# EAGLE schematic RFIDLER V22 beta (EAGLE 6.5.0)
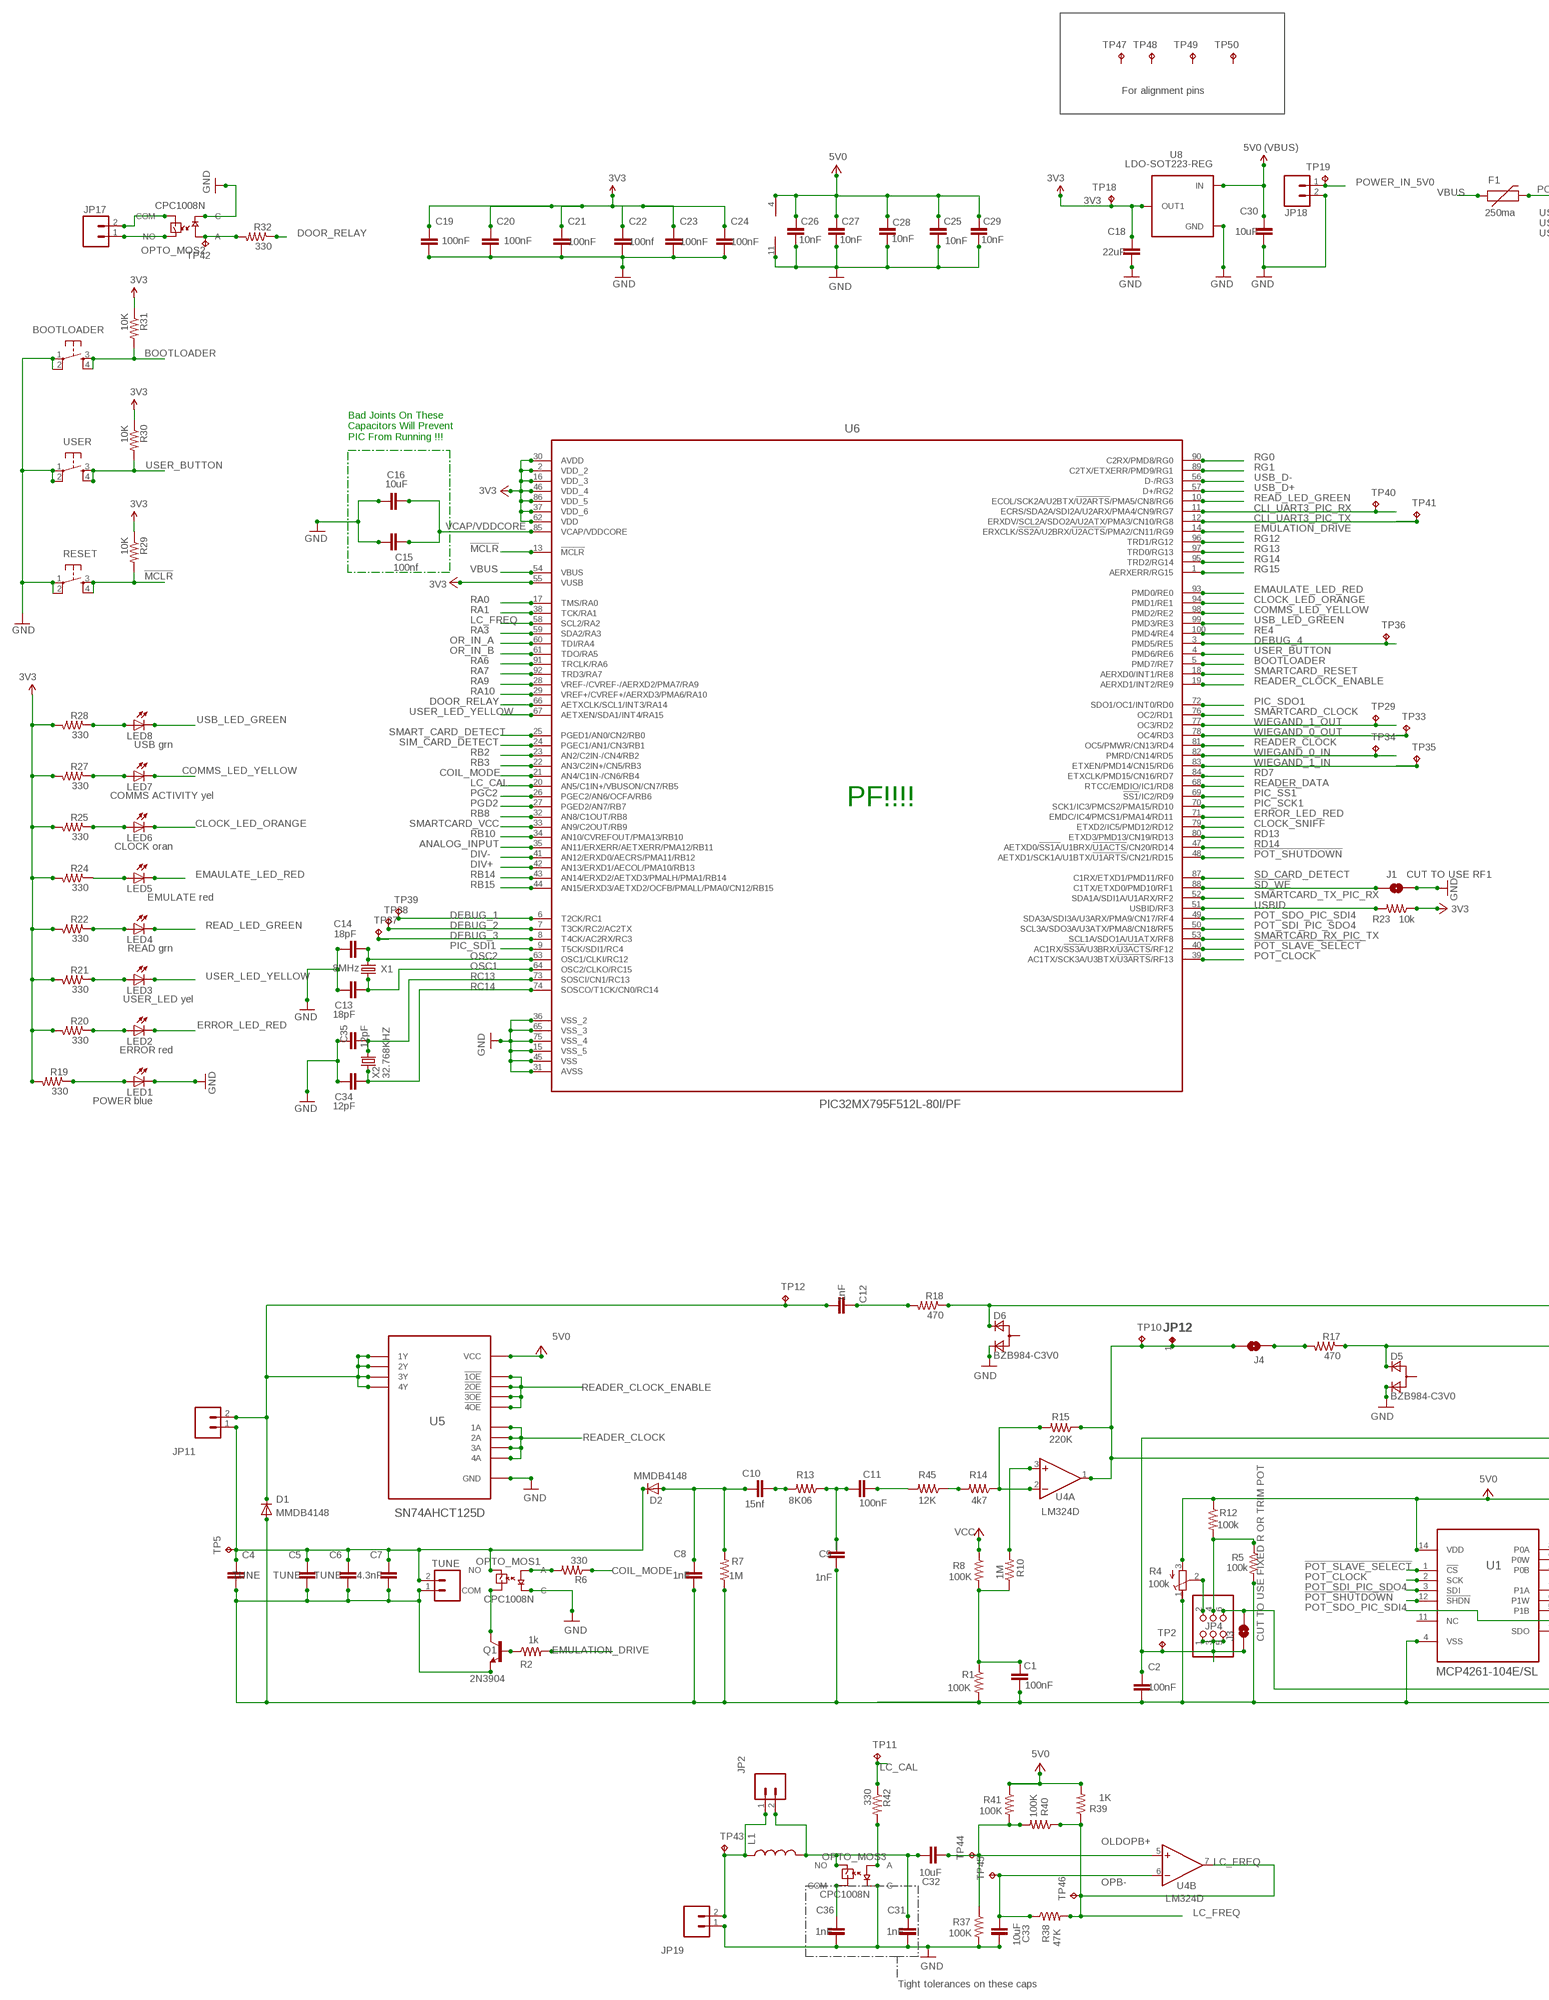
[diagram p0: schematic, sheet 1, part 1 of 2]
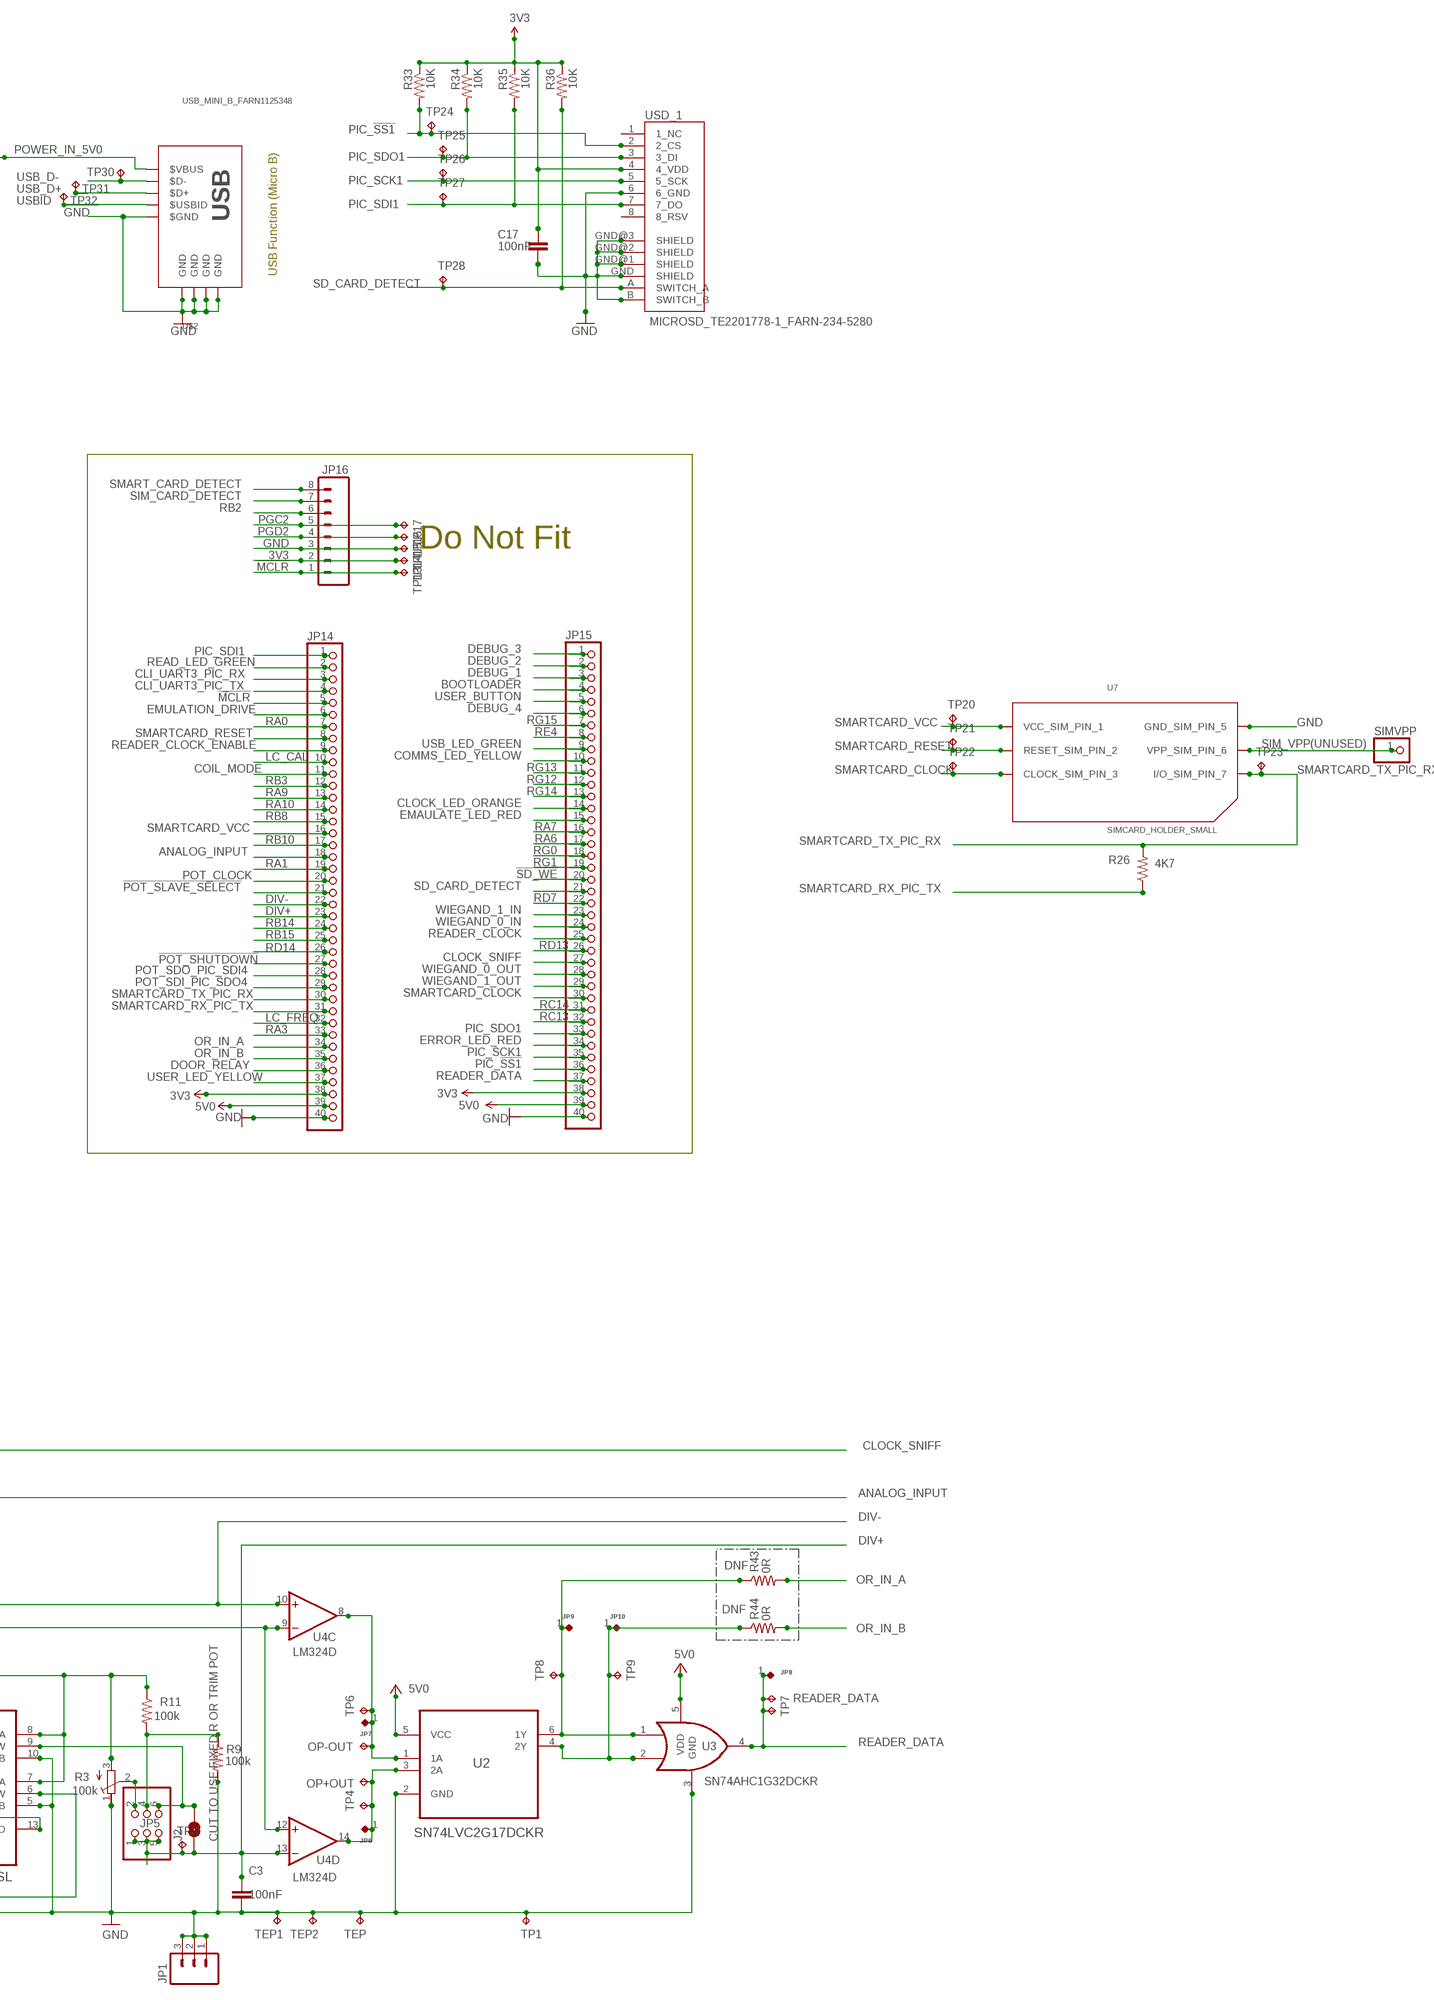
[diagram p1: schematic, sheet 1, part 2 of 2]

## Parts
BOOTLOADER  TAC_SWITCHSMD  [TACTILE_SWITCH_SMD]
C1  100nF  CAP0603-CAP  [0603-CAP]
C2  100nF  C-EUC0603  [C0603]
C3  100nF  C-EUC0603  [C0603]
C4  TUNE  C-EUC0603  [C0603]
C5  TUNE  C-EUC0603  [C0603]
C6  TUNE  C-EUC0603  [C0603]
C7  4.3nF  C-EUC0603  [C0603]
C8  1nF  C-EUC0603  [C0603]
C9  1nF  C-EUC0603  [C0603]
C10  15nf  C-EUC0603  [C0603]
C11  100nF  C-EUC0603  [C0603]
C12  1nF  C-EUC0603  [C0603]
C13  18pF  C-EUC0603  [C0603]
C14  18pF  C-EUC0603  [C0603]
C15  100nf  C-EUC0603  [C0603]
C16  10uF  C-EUC0805  [C0805]
C17  100nF  C-EUC0603  [C0603]
C18  22uF  C-EUC0805  [C0805]
C19  100nF  C-EUC0603  [C0603]
C20  100nF  C-EUC0603  [C0603]
C21  100nF  C-EUC0603  [C0603]
C22  100nf  C-EUC0603  [C0603]
C23  100nF  C-EUC0603  [C0603]
C24  100nF  C-EUC0603  [C0603]
C25  10nF  C-EUC0603  [C0603]
C26  10nF  C-EUC0603  [C0603]
C27  10nF  C-EUC0603  [C0603]
C28  10nF  C-EUC0603  [C0603]
C29  10nF  C-EUC0603  [C0603]
C30  10uF  C-EUC0805  [C0805]
C31  1nF  C-EUC0603  [C0603]
C32  10uF  C-EUC0805  [C0805]
C33  10uF  C-EUC0805  [C0805]
C34  12pF  C-EUC0603  [C0603]
C35  12pF  C-EUC0603  [C0603]
C36  1nF  C-EUC0603  [C0603]
D1  MMDB4148  DIODESOT23  [SOT23-3]
D2  MMDB4148  DIODESOT23  [SOT23-3]
D5  BZB984-C3V0  BZB984  [SOT663]
D6  BZB984-C3V0  BZB984  [SOT663]
F1  250ma  PTCSMD  [PTC-1206]
J1  CUT TO USE RF1  SOLDERJUMPERTRACE  [SJ_2S-TRACE]
J2  CUT TO USE FIXED R OR TRIM POT  SOLDERJUMPERTRACE  [SJ_2S-TRACE]
J3  CUT TO USE FIXED R OR TRIM POT  SOLDERJUMPERTRACE  [SJ_2S-TRACE]
J4  SOLDERJUMPERTRACE  [SJ_2S-TRACE]
JP1  M03LOCK_LONGPADS  [1X03_LOCK_LONGPADS]
JP2  M02LOCK_LONGPADS  [1X02_LOCK_LONGPADS]
JP4  PINHD-2X3  [2X03]
JP5  PINHD-2X3  [2X03]
JP6  PINHD-1X1  [1X01]
JP7  PINHD-1X1  [1X01]
JP8  PINHD-1X1  [1X01]
JP9  PINHD-1X1  [1X01]
JP10  PINHD-1X1  [1X01]
JP11  M02LOCK_LONGPADS  [1X02_LOCK_LONGPADS]
JP12  PINHD-1X1  [1X01]
JP14  PINHD-1X40  [1X40]
JP15  PINHD-1X40  [1X40]
JP16  M08  [1X08]
JP17  M02LOCK_LONGPADS  [1X02_LOCK_LONGPADS]
JP18  M02LOCK_LONGPADS  [1X02_LOCK_LONGPADS]
JP19  M02LOCK_LONGPADS  [1X02_LOCK_LONGPADS]
L1  INDUCTOR0603  [0603]
LED1  POWER blue  LED0603  [LED-0603]
LED2  ERROR red  LED0603  [LED-0603]
LED3  USER_LED yel  LED0603  [LED-0603]
LED4  READ grn  LED0603  [LED-0603]
LED5  EMULATE red  LED0603  [LED-0603]
LED6  CLOCK oran  LED0603  [LED-0603]
LED7  COMMS ACTIVITY yel  LED0603  [LED-0603]
LED8  USB grn  LED0603  [LED-0603]
OP+OUT  TPPAD1-13  [P1-13]
OP-OUT  TPPAD1-13  [P1-13]
OPTO_MOS1  CPC1008N  [CPC1008N]
OPTO_MOS2  CPC1008N  [CPC1008N]
OPTO_MOS3  CPC1008N  [CPC1008N]
Q1  2N3904  TRANSISTOR_NPNSOT323(SC-70)  [SOT323]
R1  100K  R-US_R0603  [R0603]
R2  1k  R-US_R0603  [R0603]
R3  100k  R-TRIMMT93XA  [RTRIMT93XA]
R4  100k  R-TRIMMT93XA  [RTRIMT93XA]
R5  100k  R-US_R0603  [R0603]
R6  330  R-US_R0603  [R0603]
R7  1M  R-US_R0603  [R0603]
R8  100K  R-US_R0603  [R0603]
R9  100k  R-US_R0603  [R0603]
R10  1M  R-US_R0603  [R0603]
R11  100k  R-US_R0603  [R0603]
R12  100k  R-US_R0603  [R0603]
R13  8K06  R-US_R0603  [R0603]
R14  4k7  R-US_R0603  [R0603]
R15  220K  R-US_R0603  [R0603]
R17  470  R-US_R0603  [R0603]
R18  470  R-US_R0603  [R0603]
R19  330  R-US_R0603  [R0603]
R20  330  R-US_R0603  [R0603]
R21  330  R-US_R0603  [R0603]
R22  330  R-US_R0603  [R0603]
R23  10k  R-US_R0603  [R0603]
R24  330  R-US_R0603  [R0603]
R25  330  R-US_R0603  [R0603]
R26  4K7  R-US_R0603  [R0603]
R27  330  R-US_R0603  [R0603]
R28  330  R-US_R0603  [R0603]
R29  10K  R-US_R0603  [R0603]
R30  10K  R-US_R0603  [R0603]
R31  10K  R-US_R0603  [R0603]
R32  330  R-US_R0603  [R0603]
R33  10K  R-US_R0603  [R0603]
R34  10K  R-US_R0603  [R0603]
R35  10K  R-US_R0603  [R0603]
R36  10K  R-US_R0603  [R0603]
R37  100K  R-US_R0603  [R0603]
R38  47K  R-US_R0603  [R0603]
R39  1K  R-US_R0603  [R0603]
R40  100K  R-US_R0603  [R0603]
R41  100K  R-US_R0603  [R0603]
R42  330  R-US_R0603  [R0603]
R43  0R  R-US_R0603  [R0603]
R44  0R  R-US_R0603  [R0603]
R45  12K  R-US_R0603  [R0603]
READER_DATA  TPPAD1-13  [P1-13]
RESET  TAC_SWITCHSMD  [TACTILE_SWITCH_SMD]
SIMVPP  PINHD-1X1  [1X01]
TEP  TPPAD1-13  [P1-13]
TEP1  TPPAD1-13  [P1-13]
TEP2  TPPAD1-13  [P1-13]
TP1  DOWNS_ORIN1  TPTP20R  [TP20R]
TP2  DIV-  TPTP20R  [TP20R]
TP3  DIV+  TPTP20R  [TP20R]
TP4  OP-OUT  TPTP20R  [TP20R]
TP5  COIL_B  TPTP20R  [TP20R]
TP6  OP+OUT  TPTP20R  [TP20R]
TP7  READER_DATA  TPTP20R  [TP20R]
TP8  UPS_ORIN1  TPTP20R  [TP20R]
TP9  DOWNS_ORIN1  TPTP20R  [TP20R]
TP10  RAW_READER_OUT  TPTP20R  [TP20R]
TP11  LC_CAL  TPTP20R  [TP20R]
TP12  COIL_A  TPTP20R  [TP20R]
TP13  !MCLR  TPTP20R  [TP20R]
TP14  3V3  TPTP20R  [TP20R]
TP15  GND  TPTP20R  [TP20R]
TP16  PGD2  TPTP20R  [TP20R]
TP17  PGC2  TPTP20R  [TP20R]
TP18  DOWNS_ORIN1  TPTP20R  [TP20R]
TP19  POWER_IN_5V0  TPTP20R  [TP20R]
TP20  SMARTCARD_VCC  TPTP20R  [TP20R]
TP21  SMARTCARD_RESET  TPTP20R  [TP20R]
TP22  SMARTCARD_CLOCK  TPTP20R  [TP20R]
TP23  SMARTCARD_TX_PIC_RX  TPTP20R  [TP20R]
TP24  PIC_!SS1  TPTP20R  [TP20R]
TP25  PIC_SDO1  TPTP20R  [TP20R]
TP26  PIC_SCK1  TPTP20R  [TP20R]
TP27  PIC_SDI1  TPTP20R  [TP20R]
TP28  SD_CARD_DETECT  TPTP20R  [TP20R]
TP29  WIEGAND_1_OUT  TPTP20R  [TP20R]
TP30  USB_D-  TPTP20R  [TP20R]
TP31  USB_D+  TPTP20R  [TP20R]
TP32  USBID  TPTP20R  [TP20R]
TP33  WIE0OUT  TPTP20R  [TP20R]
TP34  WIE0IN  TPTP20R  [TP20R]
TP35  WIE1IN  TPTP20R  [TP20R]
TP36  DEBUG_4  TPTP20R  [TP20R]
TP37  DEBUG_3  TPTP20R  [TP20R]
TP38  DEBUG_2  TPTP20R  [TP20R]
TP39  DEBUG_1  TPTP20R  [TP20R]
TP40  CLI_UART3_PIC_RX  TPTP20R  [TP20R]
TP41  CLI_UART3_PIC_TX  TPTP20R  [TP20R]
TP42  RELAY  TPTP20R  [TP20R]
TP43  LC_COIL  TPTP20R  [TP20R]
TP44  LC+  TPTP20R  [TP20R]
TP45  LC-  TPTP20R  [TP20R]
TP46  LCOUT  TPTP20R  [TP20R]
TP47  PEG4  TPTP20R  [TP20R]
TP48  PEG1  TPTP20R  [TP20R]
TP49  PEG3  TPTP20R  [TP20R]
TP50  PEG2  TPTP20R  [TP20R]
TUNE  M02LOCK_LONGPADS  [1X02_LOCK_LONGPADS]
U1  MCP4261-104E/SL  [SOIC127P600X175-14N]
U2  SN74LVC2G17DCKR  [SOT65P210X110-6N]
U3  SN74AHC1G32DCKR  [SC70-5L]
U4  LM324D  [SO14]
U5  SN74AHCT125D  [SOIC127P600X175-14N]
U6  PIC32MX795F512L-80I/PF  [QFP50P1600X1600X120-100N]
U7  SIMCARD_HOLDER_SMALL  [SIM_CARD_CONN]
U8  LDO-SOT223-REG  [SOT223]
U$2  USB_MINI_B_FARN1125348  [USB_MINI_B_FARN1125348]
USD_1  MICROSD_TE2201778-1_FARN-234-5280  [MICROSD_TE2201778-1_FARN-234-5280]
USER  TAC_SWITCHSMD  [TACTILE_SWITCH_SMD]
X1  8MHz  CRYSTALHC49UP  [HC49UP]
X2  32.768KHZ  CRYSTALTC38H  [TC38H]

## Nets
3V3: C17.1 C18.1 C19.1 C20.1 C21.1 C22.1 C23.1 C24.1 JP14.38 JP15.38 JP16.2 R19.2 R20.2 R21.2 R22.2 R23.1 R24.2 R25.2 R27.2 R28.2 R29.1 R30.1 R31.1 R33.1 R34.1 R35.1 R36.1 TP14.TP TP18.TP U6.2(VDD_2) U6.16(VDD_3) U6.30(AVDD) U6.37(VDD_6) U6.46(VDD_4) U6.55(VUSB) U6.62(VDD) U6.86(VDD_5) U8.P$2@2(OUT1) USD_1.4(4_VDD)
!MCLR: JP14.5 JP16.1 R29.2 RESET.3 RESET.4 TP13.TP U6.13(!MCLR)
!POT_SHUTDOWN: JP14.27 U1.12(!SHDN) U6.48(AETXD1/SCK1A/U1BTX/!U1ARTS!/CN21/RD15)
!POT_SLAVE_SELECT: JP14.21 U1.1(!CS) U6.40(AC1RX/!SS3A!/U3BRX/!U3ACTS!/RF12)
!SD_WE: J1.1 JP15.20 U6.88(C1TX/ETXD0/PMD10/RF1)
ANALOG_INPUT: D5.P$1(C1) JP14.18 R17.1 U6.35(AN11/ERXERR/AETXERR/PMA12/RB11)
BOOTLOADER: BOOTLOADER.3 BOOTLOADER.4 JP15.4 R31.2 U6.5(PMD7/RE7)
CLI_UART3_PIC_RX: JP14.3 TP40.TP U6.11(ECRS/SDA2A/SDI2A/U2ARX/PMA4/CN9/RG7)
CLI_UART3_PIC_TX: JP14.4 TP41.TP U6.12(ERXDV/SCL2A/SDO2A/U2ATX/PMA3/CN10/RG8)
CLOCK: C12.2 D1.3(C) JP11.2 TP12.TP U5.3(1Y) U5.6(2Y) U5.8(3Y) U5.11(4Y)
CLOCK_LED_ORANGE: JP15.14 LED6.C U6.94(PMD1/RE1)
CLOCK_SNIFF: D6.P$1(C1) JP15.27 R18.1 U6.79(ETXD2/IC5/PMD12/RD12)
COIL: C4.1 C5.1 C6.1 C7.1 D2.3(C) JP11.1 OPTO_MOS1.NO TP5.TP TUNE.2
COIL_MODE: JP14.11 R6.1 U6.21(AN4/C1IN-/CN6/RB4)
COMMS_LED_YELLOW: JP15.10 LED7.C U6.98(PMD2/RE2)
DEBUG_1: JP15.3 TP39.TP U6.6(T2CK/RC1)
DEBUG_2: JP15.2 TP38.TP U6.7(T3CK/RC2/AC2TX)
DEBUG_3: JP15.1 TP37.TP U6.8(T4CK/AC2RX/RC3)
DEBUG_4: JP15.6 TP36.TP U6.3(PMD5/RE5)
DIV+: C3.1 J2.1 JP5.1 JP5.3 JP5.5 JP14.23 TP3.TP U4.13(D:-IN) U6.42(AN13/ERXD1/AECOL/PMA10/RB13)
DIV-: C2.1 J3.1 JP4.1 JP4.3 JP4.5 JP14.22 TP2.TP U4.10(C:+IN) U6.41(AN12/ERXD0/AECRS/PMA11/RB12)
DOOR_RELAY: JP14.36 R32.1 U6.66(AETXCLK/SCL1/INT3/RA14)
DOWNS_ORIN1: JP10.1 R44.1 TP9.TP U2.4(2Y) U3.2(B)
EMAULATE_LED_RED: JP15.15 LED5.C U6.93(PMD0/RE0)
EMULATION_DRIVE: JP14.6 R2.2 U6.14(ERXCLK/!SS2A!/U2BRX/!U2ACTS!/PMA2/CN11/RG9)
ERROR_LED_RED: JP15.34 LED2.C U6.71(EMDC/IC4/PMCS1/PMA14/RD11)
GND [power]: BOOTLOADER.1 BOOTLOADER.2 C1.2 C2.2 C3.2 C4.2 C5.2 C6.2 C7.2 C8.2 C9.1 C13.1 C14.1 C15.2 C16.2 C17.2 C18.2 C19.2 C20.2 C21.2 C22.2 C23.2 C24.2 C25.1 C26.2 C27.2 C28.2 C29.2 C30.2 C31.2 C33.1 C34.1 C35.1 C36.2 D1.1(A) D5.P$2(C2) D6.P$2(C2) J1.2 JP1.1 JP1.2 JP1.3 JP14.40 JP15.40 JP16.3 JP18.2 JP19.1 LED1.C OPTO_MOS1.C OPTO_MOS2.C OPTO_MOS3.C Q1.3(E) R1.2 R3.1(A) R4.1(A) R5.2 R7.1 R9.2 R37.2 RESET.1 RESET.2 TEP1.TP TEP2.TP TEP.TP TP1.TP TP15.TP TUNE.1 U1.4(VSS) U1.5(P1B) U1.10(P0B) U2.2(GND) U3.3(GND) U4.11(P:V-) U5.7(GND) U6.15(VSS_5) U6.31(AVSS) U6.36(VSS_2) U6.45(VSS) U6.65(VSS_3) U6.75(VSS_4) U7.CARD_GND_PIN5(GND_SIM_PIN_5) U8.P$1(GND) U$2.GND($GND) U$2.GND@1(GND) U$2.GND@2(GND) U$2.GND@3(GND) U$2.GND@4(GND) USD_1.6(6_GND) USD_1.B(SWITCH_B) USD_1.GND(SHIELD) USD_1.GND@1(SHIELD) USD_1.GND@2(SHIELD) USD_1.GND@3(SHIELD) USER.1 USER.2
LC_CAL: JP14.10 R42.1 TP11.TP U6.20(AN5/C1IN+/VBUSON/CN7/RB5)
LC_COIL: C31.1 C32.1 JP2.2 L1.2 OPTO_MOS3.NO
LC_FREQ: JP14.32 R38.2 R39.1 R40.1 TP46.TP U4.7(B:OUT) U6.58(SCL2/RA2)
N$2: JP4.2 R4.2(S)
N$3: OPTO_MOS3.A R42.2
N$4: C36.1 OPTO_MOS3.COM
N$5: C8.1 C10.1 D2.1(A) R7.2
N$6: C10.2 R13.2
N$7: C9.2 C11.2 R13.1
N$8: C11.1 R45.2
N$9: R14.1 R15.2 U4.2(A:-IN)
N$10: Q1.1(B) R2.1
N$11: JP2.1 JP19.2 L1.1 TP43.TP
N$12: R10.2 U4.3(A:+IN)
N$13: J3.2 JP4.6 U1.6(P1W)
N$14: LED4.A R22.1
N$16: JP5.2 R3.2(S)
N$17: LED3.A R21.1
N$18: J2.2 JP5.6 U1.9(P0W)
N$19: OPTO_MOS1.COM Q1.2(C)
N$21: JP4.4 R5.1 R12.2
N$24: OPTO_MOS1.A R6.2
N$25: JP5.4 R9.1 R11.2
N$26: C12.1 R18.2
N$27: LED1.A R19.1
N$28: LED2.A R20.1
N$29: OPTO_MOS2.A R32.2 TP42.TP
N$30: JP17.1 OPTO_MOS2.NO
N$31: JP17.2 OPTO_MOS2.COM
N$35: J4.1 R17.2
N$38: R14.2 R45.1
N$105: LED8.A R28.1
N$106: LED7.A R27.1
N$107: LED5.A R24.1
N$108: LED6.A R25.1
OLDOPB+: C32.2 R37.1 R40.2 R41.2 TP44.TP U4.5(B:+IN)
OP+OUT: JP7.1 OP-OUT.TP TP6.TP U2.1(1A) U4.8(C:OUT)
OP-OUT: JP6.1 OP+OUT.TP TP4.TP U2.3(2A) U4.14(D:OUT)
OPB-: C33.2 R38.1 TP45.TP U4.6(B:-IN)
OR_IN_A: JP14.34 R43.2 U6.60(TDI/RA4)
OR_IN_B: JP14.35 R44.2 U6.61(TDO/RA5)
OSC1: C13.2 U6.64(OSC2/CLKO/RC15) X1.1
OSC2: C14.2 U6.63(OSC1/CLKI/RC12) X1.2
PGC2: JP16.5 TP17.TP U6.26(PGEC2/AN6/OCFA/RB6)
PGD2: JP16.4 TP16.TP U6.27(PGED2/AN7/RB7)
PIC_!SS1: JP15.36 R33.2 TP24.TP U6.69(!SS1!/IC2/RD9) USD_1.2(2_CS)
PIC_SCK1: JP15.35 TP26.TP U6.70(SCK1/IC3/PMCS2/PMA15/RD10) USD_1.5(5_SCK)
PIC_SDI1: JP14.1 R35.2 TP27.TP U6.9(T5CK/SDI1/RC4) USD_1.7(7_DO)
PIC_SDO1: JP15.33 R34.2 TP25.TP U6.72(SDO1/OC1/INT0/RD0) USD_1.3(3_DI)
POT_CLOCK: JP14.20 U1.2(SCK) U6.39(AC1TX/SCK3A/U3BTX/!U3ARTS!/RF13)
POT_SDI_PIC_SDO4: JP14.29 U1.3(SDI) U6.50(SCL3A/SDO3A/U3ATX/PMA8/CN18/RF5)
POT_SDO_PIC_SDI4: JP14.28 U1.13(SDO) U6.49(SDA3A/SDI3A/U3ARX/PMA9/CN17/RF4)
POWER_IN_5V0: F1.2 JP18.1 TP19.TP U$2.VBUS($VBUS)
RA0: JP14.7 U6.17(TMS/RA0)
RA1: JP14.19 U6.38(TCK/RA1)
RA3: JP14.33 U6.59(SDA2/RA3)
RA6: JP15.17 U6.91(TRCLK/RA6)
RA7: JP15.16 U6.92(TRD3/RA7)
RA9: JP14.13 U6.28(VREF-/CVREF-/AERXD2/PMA7/RA9)
RA10: JP14.14 U6.29(VREF+/CVREF+/AERXD3/PMA6/RA10)
RAW_READER_OUT: J4.2 JP12.1 R15.1 TP10.TP U4.1(A:OUT) U4.9(C:-IN) U4.12(D:+IN)
RB2: JP16.6 U6.23(AN2/C2IN-/CN4/RB2)
RB3: JP14.12 U6.22(AN3/C2IN+/CN5/RB3)
RB8: JP14.15 U6.32(AN8/C1OUT/RB8)
RB10: JP14.17 U6.34(AN10/CVREFOUT/PMA13/RB10)
RB14: JP14.24 U6.43(AN14/ERXD2/AETXD3/PMALH/PMA1/RB14)
RB15: JP14.25 U6.44(AN15/ERXD3/AETXD2/OCFB/PMALL/PMA0/CN12/RB15)
RC13: C35.2 JP15.32 U6.73(SOSCI/CN1/RC13) X2.2
RC14: C34.2 JP15.31 U6.74(SOSCO/T1CK/CN0/RC14) X2.1
RD7: JP15.22 U6.84(ETXCLK/PMD15/CN16/RD7)
RD13: JP15.26 U6.80(ETXD3/PMD13/CN19/RD13)
RD14: JP14.26 U6.47(AETXD0/!SS1A!/U1BRX/!U1ACTS!/CN20/RD14)
RE4: JP15.8 U6.100(PMD4/RE4)
READ_LED_GREEN: JP14.2 LED4.C U6.10(ECOL/SCK2A/U2BTX/!U2ARTS!/PMA5/CN8/RG6)
READER_CLOCK: JP15.25 U5.2(1A) U5.5(2A) U5.9(3A) U5.12(4A) U6.81(OC5/PMWR/CN13/RD4)
READER_CLOCK_ENABLE: JP14.9 U5.1(!1OE) U5.4(!2OE) U5.10(!3OE) U5.13(!4OE) U6.19(AERXD1/INT2/RE9)
READER_DATA: JP8.1 JP15.37 READER_DATA.TP TP7.TP U3.4(Y) U6.68(RTCC/EMDIO/IC1/RD8)
RG0: JP15.18 U6.90(C2RX/PMD8/RG0)
RG1: JP15.19 U6.89(C2TX/ETXERR/PMD9/RG1)
RG12: JP15.12 U6.96(TRD1/RG12)
RG13: JP15.11 U6.97(TRD0/RG13)
RG14: JP15.13 U6.95(TRD2/RG14)
RG15: JP15.7 U6.1(AERXERR/RG15)
SD_CARD_DETECT: JP15.21 R36.2 TP28.TP U6.87(C1RX/ETXD1/PMD11/RF0) USD_1.A(SWITCH_A)
SIM_CARD_DETECT: JP16.7 U6.24(PGEC1/AN1/CN3/RB1)
SIM_VPP(UNUSED): SIMVPP.1 U7.CARD_VPP_PIN6(VPP_SIM_PIN_6)
SMART_CARD_DETECT: JP16.8 U6.25(PGED1/AN0/CN2/RB0)
SMARTCARD_CLOCK: JP15.30 TP22.TP U6.76(OC2/RD1) U7.CARD_CLK_PIN3(CLOCK_SIM_PIN_3)
SMARTCARD_RESET: JP14.8 TP21.TP U6.18(AERXD0/INT1/RE8) U7.CARD_RESET_PIN2(RESET_SIM_PIN_2)
SMARTCARD_RX_PIC_TX: JP14.31 R26.1 U6.53(SCL1A/SDO1A/U1ATX/RF8)
SMARTCARD_TX_PIC_RX: JP14.30 R26.2 TP23.TP U6.52(SDA1A/SDI1A/U1ARX/RF2) U7.CARD_IO_PIN7(I/O_SIM_PIN_7)
SMARTCARD_VCC: JP14.16 TP20.TP U6.33(AN9/C2OUT/RB9) U7.CARD_VCC_PIN1(VCC_SIM_PIN_1)
UPS_ORIN1: JP9.1 R43.1 TP8.TP U2.6(1Y) U3.1(A)
USB_D+: TP31.TP U6.57(D+/RG2) U$2.D+($D+)
USB_D-: TP30.TP U6.56(D-/RG3) U$2.D-($D-)
USB_LED_GREEN: JP15.9 LED8.C U6.99(PMD3/RE3)
USBID: R23.2 TP32.TP U6.51(USBID/RF3) U$2.ID($USBID)
USER_BUTTON: JP15.5 R30.2 U6.4(PMD6/RE6) USER.3 USER.4
USER_LED_YELLOW: JP14.37 LED3.C U6.67(AETXEN/SDA1/INT4/RA15)
VBUS: C25.2 C26.1 C27.1 C28.1 C29.1 C30.1 F1.1 JP14.39 JP15.39 R3.3(E) R4.3(E) R8.1 R11.1 R12.1 R39.2 R41.1 U1.7(P1A) U1.8(P0A) U1.14(VDD) U2.5(VCC) U3.5(VDD) U4.4(P:V+) U5.14(VCC) U6.54(VBUS) U8.P$3(IN) ; supply symbol labelled 5V0, VCC, 5V0 (VBUS)
VCAP/VDDCORE: C15.1 C16.1 U6.85(VCAP/VDDCORE)
VDIVBIAS: C1.1 R1.1 R8.2 R10.1
WIEGAND_0_IN: JP15.24 TP34.TP U6.82(PMRD/CN14/RD5)
WIEGAND_0_OUT: JP15.28 TP33.TP U6.78(OC4/RD3)
WIEGAND_1_IN: JP15.23 TP35.TP U6.83(ETXEN/PMD14/CN15/RD6)
WIEGAND_1_OUT: JP15.29 TP29.TP U6.77(OC3/RD2)
Unconnected: D5.P$3(A) D6.P$3(A) TP47.TP TP48.TP TP49.TP TP50.TP U1.11(NC) USD_1.1(1_NC) USD_1.8(8_RSV)

## Notes on the sheet
- For alignment pins
- USB Function (Micro B)
- Bad Joints On These
  Capacitors Will Prevent
  PIC From Running !!!
- Do Not Fit
- PF!!!!
- DNF
- DNF
- Tight tolerances on these caps

## Library data of the parts
BOOTLOADER RESET USER = SparkFun4-13-10:TAC_SWITCH: Momentary Switch Button commonly used for reset or general input. Spark Fun Electronics SKU : COM-00097; AMR_RECHECK_PART: ?; FARNELL: 9471880; FARNELL_PRICE: ?; FARNELL_PRICE_QUANTITY: ?; TOLERANCE: ?
C1 = SparkFun-Capacitors:CAP: Capacitor Standard 0603 ceramic capacitor, and 0.1" leaded capacitor.; AMR_RECHECK_PART: y; FARNELL: 2332586; FARNELL_PRICE: ?; FARNELL_PRICE_QUANTITY: ?; PARTNO: currently rs 264-4646; TOLERANCE: ?
C2 = resistor:C-EU: CAPACITOR, European symbol; AMR_RECHECK_PART: Y; FARNELL: 2332586; FARNELL_PRICE: ?; FARNELL_PRICE_QUANTITY: ?; PARTNO: currently rs 264-4646; TOLERANCE: ?
C3 = resistor:C-EU: CAPACITOR, European symbol; AMR_RECHECK_PART: ?; FARNELL: 2332586; FARNELL_PRICE: ?; FARNELL_PRICE_QUANTITY: ?; PARTNO: ?; TOLERANCE: ?
C4-C6 = resistor:C-EU: CAPACITOR, European symbol; AMR_RECHECK_PART: ?; FARNELL: DNF; FARNELL_PRICE: ?; FARNELL_PRICE_QUANTITY: ?; PARTNO: ?; TOLERANCE: ?
C7 = resistor:C-EU: CAPACITOR, European symbol; AMR_RECHECK_PART: ?; FARNELL: 1865494; FARNELL_PRICE: ?; FARNELL_PRICE_QUANTITY: ?; PARTNO: ?; TOLERANCE: 1%
C8 C9 C12 = resistor:C-EU: CAPACITOR, European symbol; AMR_RECHECK_PART: ?; FARNELL: 1414606; FARNELL_PRICE: ?; FARNELL_PRICE_QUANTITY: ?; PARTNO: ?; TOLERANCE: ?
C10 = resistor:C-EU: CAPACITOR, European symbol; AMR_RECHECK_PART: ?; FARNELL: 2070401; FARNELL_PRICE: ?; FARNELL_PRICE_QUANTITY: ?; PARTNO: ?; TOLERANCE: ?
C11 = resistor:C-EU: CAPACITOR, European symbol; AMR_RECHECK_PART: y; FARNELL: 2332586; FARNELL_PRICE: ?; FARNELL_PRICE_QUANTITY: ?; PARTNO: currently rs2644646; TOLERANCE: ?
C13 C14 = resistor:C-EU: CAPACITOR, European symbol; AMR_RECHECK_PART: ?; FARNELL: 1612182; FARNELL_PRICE: ?; FARNELL_PRICE_QUANTITY: ?; TOLERANCE: ?
C15 = resistor:C-EU: CAPACITOR, European symbol; AMR_RECHECK_PART: y; FARNELL: 2332586; FARNELL_PRICE: ?; FARNELL_PRICE_QUANTITY: ?; TOLERANCE: Cuurently rs 264 4646
C16 C30 = resistor:C-EU: CAPACITOR, European symbol; AMR_RECHECK_PART: ?; FARNELL: 1867958; FARNELL_PRICE: ?; FARNELL_PRICE_QUANTITY: ?; TOLERANCE: ?
C17 = resistor:C-EU: CAPACITOR, European symbol; AMR_RECHECK_PART: y; FARNELL: DNF; FARNELL_PRICE: ?; FARNELL_PRICE_QUANTITY: ?; TOLERANCE: Crrently rs 264 4646; XFARNELL: 2332586
C18 = resistor:C-EU: CAPACITOR, European symbol; AMR_RECHECK_PART: ?; FARNELL: 1867956; FARNELL_PRICE: ?; FARNELL_PRICE_QUANTITY: ?; TOLERANCE: ?
C19-C24 = resistor:C-EU: CAPACITOR, European symbol; AMR_RECHECK_PART: y; FARNELL: 2332586; FARNELL_PRICE: ?; FARNELL_PRICE_QUANTITY: ?; TOLERANCE: Crrently rs 264 4646
C25-C29 = resistor:C-EU: CAPACITOR, European symbol; AMR_RECHECK_PART: ?; FARNELL: 1301715; FARNELL_PRICE: ?; FARNELL_PRICE_QUANTITY: ?; PARTNO: ?; TOLERANCE: ?
C31 C36 = resistor:C-EU: CAPACITOR, European symbol; AMR_RECHECK_PART: ?; FARNELL: DNF; FARNELL_PRICE: ?; FARNELL_PRICE_QUANTITY: ?; PARTNO: ?; TOLERANCE: ?; XFARNELL: 1414606
C32 C33 = resistor:C-EU: CAPACITOR, European symbol; AMR_RECHECK_PART: ?; FARNELL: DNF; FARNELL_PRICE: ?; FARNELL_PRICE_QUANTITY: ?; TOLERANCE: ?; XFARNELL: 1867958
C34 C35 = resistor:C-EU: CAPACITOR, European symbol; AMR_RECHECK_PART: ?; FARNELL: DNF; FARNELL_PRICE: ?; FARNELL_PRICE_QUANTITY: ?; TOLERANCE: ?; XFARNELL: 1907285
D1 D2 = SparkFun 26-2-11:DIODE: Diode These are standard reverse protection diodes and small signal diodes. SMA package can handle up to about 1A. SOD-323 can handle about 200mA. What the SOD-323 package when ordering, there are some mfgs out there that are 5-pin packages.; FARNELL: 2069338; FARNELL_PRICE: ?; FARNELL_PRICE_QUANTITY: ?; PARTNO: ?; TOLERANCE: ?
D5 D6 = 1FAB:BZB984: dual zener diode; FARNELL: 8735310
F1 = SparkFun:PTC: Resettable Fuse PTC Resettable Fuse. Spark Fun Electronics SKU : COM-08357; FARNELL: 1596990
J1-J4 = SparkFun-Passives:SOLDERJUMPER: Solder Jumper Standard SMD solder jumper. Used to automate production. Two varients : Normally Open and Normally Closed are the same, but have different paste layers. NC will have a large amount of paste and should jumper during reflow.
JP1 = SparkFun-Connectors:M03: Header 3 Standard 3-pin 0.1" header. Use with straight break away headers (SKU : PRT-00116), right angle break away headers (PRT-00553), swiss pins (PRT-00743), machine pins (PRT-00117), and female headers (PRT-00115). Molex polarized connector foot print use with SKU : PRT-08232 with associated crimp pins and housings.; FARNELL: DNF
JP2 JP18 JP19 TUNE = SparkFun 26-2-11:M02: Header 2 Standard 2-pin 0.1" header. Use with straight break away headers (SKU : PRT-00116), right angle break away headers (PRT-00553), swiss pins (PRT-00743), machine pins (PRT-00117), and female headers (PRT-00115). Molex polarized connector foot print use with SKU : PRT-08233 with associated crimp pins and housings.; AMR_RECHECK_PART: ?; FARNELL: DNF; FARNELL_PRICE: ?; FARNELL_PRICE_QUANTITY: ?; PARTNO: ?; TOLERANCE: ?
JP4 JP5 = pinhead:PINHD-2X3: PIN HEADER; AMR_RECHECK_PART: ?; FARNELL: DNF; FARNELL_PRICE: ?; FARNELL_PRICE_QUANTITY: ?; PARTNO: ?; TOLERANCE: ?
JP6-JP10 JP12 = 1FAB:PINHD-1X1: PIN HEADER; AMR_RECHECK_PART: ?; FARNELL: DNF; FARNELL_PRICE: ?; FARNELL_PRICE_QUANTITY: ?; TOLERANCE: ?
JP11 = SparkFun 26-2-11:M02: Header 2 Standard 2-pin 0.1" header. Use with straight break away headers (SKU : PRT-00116), right angle break away headers (PRT-00553), swiss pins (PRT-00743), machine pins (PRT-00117), and female headers (PRT-00115). Molex polarized connector foot print use with SKU : PRT-08233 with associated crimp pins and housings.; AMR_RECHECK_PART: ?; FARNELL: 1550562 standard 2 PIN HEADER; FARNELL_PRICE: ?; FARNELL_PRICE_QUANTITY: ?; PARTNO: ?; TOLERANCE: ?
JP14 JP15 = pinhead:PINHD-1X40: PIN HEADER; FARNELL: DNF
JP16 = SchmalzHaus:M08: Header 8 Standard 8-pin 0.1" header. Use with straight break away headers (SKU : PRT-00116), right angle break away headers (PRT-00553), swiss pins (PRT-00743), machine pins (PRT-00117), and female headers (PRT-00115).; AMR_RECHECK_PART: ?; FARNELL: DNF; FARNELL_PRICE: ?; FARNELL_PRICE_QUANTITY: ?; TOLERANCE: ?
JP17 = SparkFun-Connectors:M02: Header 2 Standard 2-pin 0.1" header. Use with straight break away headers (SKU : PRT-00116), right angle break away headers (PRT-00553), swiss pins (PRT-00743), machine pins (PRT-00117), and female headers (PRT-00115). Molex polarized connector foot print use with SKU : PRT-08233 with associated crimp pins and housings.; FARNELL: DNF
L1 = SparkFun17-11-11:INDUCTOR: Inductors Basic Inductor/Choke - 0603 and 1206. Footprints are not proven and vary greatly between part numbers.; FARNELL: DNF
LED1 = SparkFun:LED: LEDs Standard schematic elements and footprints for 5mm, 3mm, 1206, and 0603 sized LEDs. 5mm - Spark Fun Electronics SKU : COM-00529 (and others); AMR_RECHECK_PART: ?; FARNELL: 2217972; FARNELL_PRICE: ?; FARNELL_PRICE_QUANTITY: ?; TOLERANCE: ?
LED2 = SparkFun:LED: LEDs Standard schematic elements and footprints for 5mm, 3mm, 1206, and 0603 sized LEDs. 5mm - Spark Fun Electronics SKU : COM-00529 (and others); AMR_RECHECK_PART: ?; FARNELL: 2099221; FARNELL_PRICE: ?; FARNELL_PRICE_QUANTITY: ?; TOLERANCE: ?
LED3 LED7 = SparkFun:LED: LEDs Standard schematic elements and footprints for 5mm, 3mm, 1206, and 0603 sized LEDs. 5mm - Spark Fun Electronics SKU : COM-00529 (and others); AMR_RECHECK_PART: ?; FARNELL: 2146436; FARNELL_PRICE: ?; FARNELL_PRICE_QUANTITY: ?; TOLERANCE: ?
LED4 LED8 = SparkFun:LED: LEDs Standard schematic elements and footprints for 5mm, 3mm, 1206, and 0603 sized LEDs. 5mm - Spark Fun Electronics SKU : COM-00529 (and others); AMR_RECHECK_PART: ?; FARNELL: 2146434; FARNELL_PRICE: ?; FARNELL_PRICE_QUANTITY: ?; TOLERANCE: ?
LED5 = SparkFun:LED: LEDs Standard schematic elements and footprints for 5mm, 3mm, 1206, and 0603 sized LEDs. 5mm - Spark Fun Electronics SKU : COM-00529 (and others); AMR_RECHECK_PART: y right angled part; FARNELL: 2099221; FARNELL_PRICE: ?; FARNELL_PRICE_QUANTITY: ?; TOLERANCE: ?
LED6 = SparkFun:LED: LEDs Standard schematic elements and footprints for 5mm, 3mm, 1206, and 0603 sized LEDs. 5mm - Spark Fun Electronics SKU : COM-00529 (and others); AMR_RECHECK_PART: ?; FARNELL: 2146433; FARNELL_PRICE: ?; FARNELL_PRICE_QUANTITY: ?; TOLERANCE: ?
OP+OUT OP-OUT = testpad:TP: Test pad; AMR_RECHECK_PART: ?; FARNELL: ?; FARNELL_PRICE: ?; FARNELL_PRICE_QUANTITY: ?; PARTNO: ?; TOLERANCE: ?
OPTO_MOS1 = 1FAB:CPC1008N; FARNELL: 1653755
OPTO_MOS2 OPTO_MOS3 = 1FAB:CPC1008N; FARNELL: DNF; XFARNELL: 1653755
Q1 = SparkFun-DiscreteSemi:TRANSISTOR_NPN: Generic NPN BJT. MMBT2222 is the common NPN we use. Double check against datasheet- not all devices are the same!; AMR_RECHECK_PART: y change footprint to sot323; FARNELL: 1459102; FARNELL_PRICE: ?; FARNELL_PRICE_QUANTITY: ?; PARTNO: ?; TOLERANCE: ?
R1 R5 R8 R9 R11 R12 = resistor:R-US_: RESISTOR, American symbol; AMR_RECHECK_PART: ?; FARNELL: 9330402; FARNELL_PRICE: ?; FARNELL_PRICE_QUANTITY: ?; PARTNO: ?; TOLERANCE: ?
R2 = resistor:R-US_: RESISTOR, American symbol; AMR_RECHECK_PART: ?; FARNELL: 9238484; FARNELL_PRICE: ?; FARNELL_PRICE_QUANTITY: ?; PARTNO: ?; TOLERANCE: ?
R3 R4 = resistor:R-TRIMM: Trimm resistor; AMR_RECHECK_PART: NO; FARNELL: DNF; FARNELL_PRICE: ?; FARNELL_PRICE_QUANTITY: ?; PARTNO: ?; TOLERANCE: ?; XFARNELL: 1141380
R6 R19-R22 R24 R25 R27 R28 = resistor:R-US_: RESISTOR, American symbol; AMR_RECHECK_PART: ?; FARNELL: 9332014; FARNELL_PRICE: ?; FARNELL_PRICE_QUANTITY: ?; TOLERANCE: ?
R7 R10 = resistor:R-US_: RESISTOR, American symbol; AMR_RECHECK_PART: ?; FARNELL: 1469746; FARNELL_PRICE: ?; FARNELL_PRICE_QUANTITY: ?; PARTNO: ?; TOLERANCE: ?
R13 = resistor:R-US_: RESISTOR, American symbol; AMR_RECHECK_PART: ?; FARNELL: 1170881; FARNELL_PRICE: ?; FARNELL_PRICE_QUANTITY: ?; PARTNO: ?; TOLERANCE: ?
R14 = resistor:R-US_: RESISTOR, American symbol; AMR_RECHECK_PART: ?; FARNELL: 2078913; FARNELL_PRICE: ?; FARNELL_PRICE_QUANTITY: ?; PARTNO: ?; TOLERANCE: ?
R15 = resistor:R-US_: RESISTOR, American symbol; AMR_RECHECK_PART: ?; FARNELL: 2073431; FARNELL_PRICE: ?; FARNELL_PRICE_QUANTITY: ?; PARTNO: ?; TOLERANCE: ?
R17 R18 = resistor:R-US_: RESISTOR, American symbol; AMR_RECHECK_PART: ?; FARNELL: 2333530; FARNELL_PRICE: ?; FARNELL_PRICE_QUANTITY: ?; TOLERANCE: ?
R23 = resistor:R-US_: RESISTOR, American symbol; AMR_RECHECK_PART: ?; FARNELL: 9330399; FARNELL_PRICE: ?; FARNELL_PRICE_QUANTITY: ?; PARTNO: ?; TOLERANCE: ?
R26 = resistor:R-US_: RESISTOR, American symbol; AMR_RECHECK_PART: ?; FARNELL: DNF; FARNELL_PRICE: ?; FARNELL_PRICE_QUANTITY: ?; PARTNO: ?; TOLERANCE: ?; XFARNELL: 2078913
R29-R31 = resistor:R-US_: RESISTOR, American symbol; AMR_RECHECK_PART: ?; FARNELL: 9330399; FARNELL_PRICE: ?; FARNELL_PRICE_QUANTITY: ?; TOLERANCE: ?
R32 R42 = resistor:R-US_: RESISTOR, American symbol; AMR_RECHECK_PART: ?; FARNELL: DNF; FARNELL_PRICE: ?; FARNELL_PRICE_QUANTITY: ?; TOLERANCE: ?; XFARNELL: 9332014
R33-R36 = resistor:R-US_: RESISTOR, American symbol; AMR_RECHECK_PART: ?; FARNELL: DNF; FARNELL_PRICE: ?; FARNELL_PRICE_QUANTITY: ?; TOLERANCE: ?; XFARNELL: 9330399
R37 R39-R41 = resistor:R-US_: RESISTOR, American symbol; AMR_RECHECK_PART: ?; FARNELL: DNF; FARNELL_PRICE: ?; FARNELL_PRICE_QUANTITY: ?; PARTNO: ?; TOLERANCE: ?; XFARNELL: 9330402
R38 = resistor:R-US_: RESISTOR, American symbol; AMR_RECHECK_PART: ?; FARNELL: DNF; FARNELL_PRICE: ?; FARNELL_PRICE_QUANTITY: ?; PARTNO: ?; TOLERANCE: ?; XFARNELL: 2078919
R43 R44 = resistor:R-US_: RESISTOR, American symbol; AMR_RECHECK_PART: ?; FARNELL: DNF; FARNELL_PRICE: ?; FARNELL_PRICE_QUANTITY: ?; PARTNO: ?; TOLERANCE: ?; XFARNELL: 1799375
R45 = resistor:R-US_: RESISTOR, American symbol; AMR_RECHECK_PART: ?; FARNELL: 1652834; FARNELL_PRICE: ?; FARNELL_PRICE_QUANTITY: ?; PARTNO: ?; TOLERANCE: ?
READER_DATA TEP TEP1 TEP2 = testpad:TP: Test pad; AMR_RECHECK_PART: ?; FARNELL: DNF; FARNELL_PRICE: ?; FARNELL_PRICE_QUANTITY: ?; PARTNO: ?; TOLERANCE: ?
SIMVPP = pinhead:PINHD-1X1: PIN HEADER; FARNELL: DNF; FARNELL_PRICE: ?; FARNELL_PRICE_QUANTITY: ?
TP1-TP18 TP47-TP50 = testpad:TP: Test pad
TP19-TP46 = testpad:TP: Test pad; POGOPIN: ?
U1 = 1FAB:MCP4261-104E/SL: Digital POT; AMR_RECHECK_PART: ?; FARNELL: 1840694; FARNELL_PRICE: ?; FARNELL_PRICE_QUANTITY: ?; MPN: MCP4261-104E/SL; OC_FARNELL: 1840694; OC_NEWARK: 27M0187; PACKAGE: SOIC-14; PARTNO: ?; SUPPLIER: Microchip; TOLERANCE: ?
U2 = 1FAB:SN74LVC2G17DCKR: DUAL SCHMITT-TRIGGER BUFFER; AMR_RECHECK_PART: ?; FARNELL: 1287569; FARNELL_PRICE: ?; FARNELL_PRICE_QUANTITY: ?; MPN: SN74LVC2G17DCKR; OC_FARNELL: 1287569; OC_NEWARK: 76C4208; PACKAGE: SOT-23-6; PARTNO: ?; SUPPLIER: Texas Instruments; TOLERANCE: ?
U3 = 1FAB:SN74AHC1G32DCKR: Single OR gate; AMR_RECHECK_PART: ?; FARNELL: 1287449; FARNELL_PRICE: ?; FARNELL_PRICE_QUANTITY: ?; PARTNO: ?; TOLERANCE: ?
U4 = linear:LM324: OP AMP; AMR_RECHECK_PART: ?; FARNELL: 8389233; FARNELL_PRICE: ?; FARNELL_PRICE_QUANTITY: ?; PARTNO: ?; TOLERANCE: ?
U5 = 1FAB:SN74AHCT125D: QUADRUPLE BUS BUFFER GATES WITH 3-STATE OUTPUTS; FARNELL: 1287453; FARNELL_PRICE: ?; FARNELL_PRICE_QUANTITY: ?; MPN: SN74AHCT125D; OC_FARNELL: 1287453; OC_NEWARK: 76C1498; PACKAGE: SOIC-14; SUPPLIER: Texas Instruments
U6 = 1FAB:PIC32MX795F512L-80I/PF: IC, 32BIT MCU; AMR_RECHECK_PART: ?; DESCRIPTION: IC MCU; FARNELL: 1778491; FARNELL_PRICE: ?; FARNELL_PRICE_QUANTITY: ?; MPN: PIC32MX795F512L-80I/PF; OC_FARNELL: 1778491; OC_NEWARK: 53R0338; PACKAGE: TQFP-100; SUPPLIER: Microchip; TOLERANCE: ?
U7 = 1FAB:SIMCARD_HOLDER_SMALL; FARNELL: DNF; FARNELL_PRICE: ?; FARNELL_PRICE_QUANTITY: ?
U8 = 1FAB:LDO-SOT223-REG: Regulator; FARNELL: 9778195; FARNELL_PRICE: should be replaced; FARNELL_PRICE_QUANTITY: ?
U$2 = 1FAB:USB_MINI_B_FARN1125348: Mini SMT USB Connector; FARNELL: 1125348
USD_1 = 1FAB:MICROSD_TE2201778-1_FARN-234-5280; FARNELL: DNF; XFARNELL: 2345280
X1 = crystal:CRYSTAL: CRYSTAL; AMR_RECHECK_PART: ?; FARNELL: 1842346; FARNELL_PRICE: ?; FARNELL_PRICE_QUANTITY: ?; OC_FARNELL: unknown; OC_NEWARK: unknown; TOLERANCE: ?
X2 = crystal:CRYSTAL: CRYSTAL; FARNELL: DNF; OC_FARNELL: unknown; OC_NEWARK: unknown; XFARNELL: 1611828

## Net classes
1 power: width 0.25 mm, drill 0.4 mm, clearance 0.2 mm